# Altium schematic sheet AIR_Control1_Main_080116.SchDoc
size A3
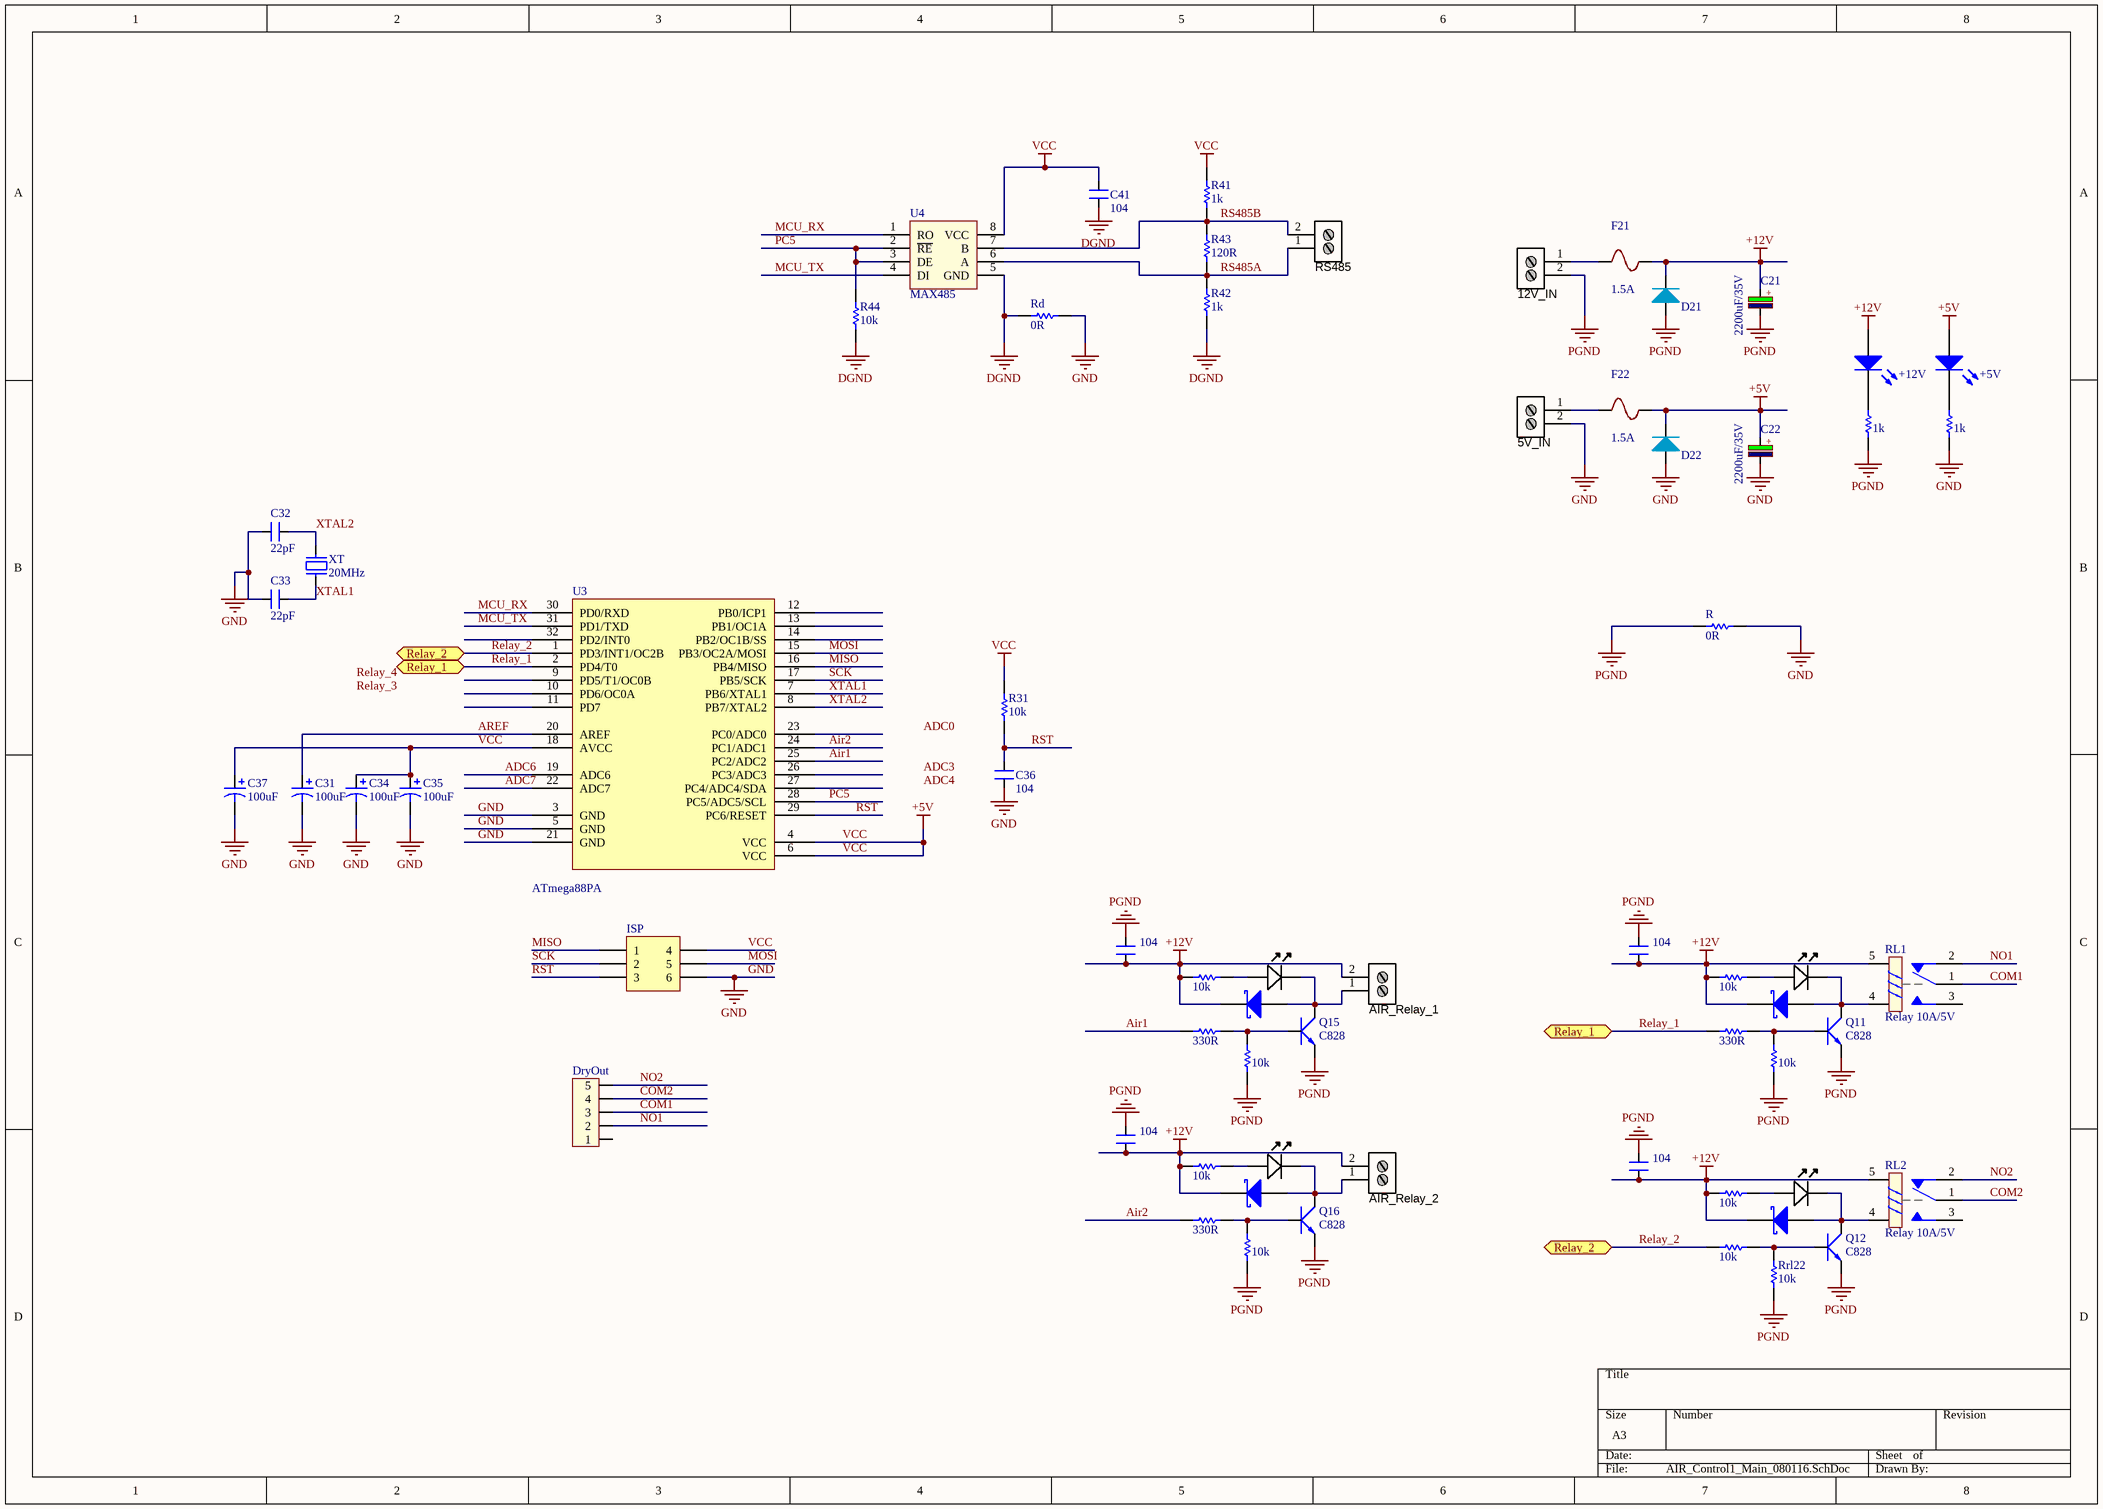
[diagram p0: AIR_Control1_Main_080116.SchDoc]

## Parts
5V_IN  Stackable ScrewTerm  [2P_PCB_ScrewTerm_200mil]  (value not drawn)
12V_IN  Stackable ScrewTerm  [2P_PCB_ScrewTerm_200mil]  (value not drawn)
+5V  Led  [LED 5mm RED]  (value not drawn)
+12V  Led  [LED 5mm RED]  (value not drawn)
AIR_Relay_1  Stackable ScrewTerm  [2P_PCB_ScrewTerm_200mil]  (value not drawn)
AIR_Relay_2  Stackable ScrewTerm  [2P_PCB_ScrewTerm_200mil]  (value not drawn)
C21  2200uF/35V  [CP_1000uF_25V]
C22  2200uF/35V  [CP_1000uF_25V]
C31  value 100uF  [CAPC2012N_F]  (hidden comment: Cap)
C32  value 22pF  [CAPC1608N]  (hidden comment: CAP NP)
C33  value 22pF  [CAPC1608N]  (hidden comment: CAP NP)
C34  value 100uF  [CAPC2012N_F]  (hidden comment: Cap)
C35  value 100uF  [CAPC2012N_F]  (hidden comment: Cap)
C36  value 104  [CAPC1608N]  (hidden comment: CAP NP)
C37  value 100uF  [CAPC2012N_F]  (hidden comment: Cap)
C41  value 104  [CAPC2012N_F]  (hidden comment: 100nF/104)
Crl1  value 104  [CAPC2012N_F]  (hidden comment: CAP NP)
Crl2  value 104  [CAPC2012N_F]  (hidden comment: CAP NP)
Crl5  value 104  [CAPC2012N_F]  (hidden comment: CAP NP)
Crl6  value 104  [CAPC2012N_F]  (hidden comment: CAP NP)
D11  Diode  [DO-214AC]  (value not drawn)
D12  Diode  [DO-214AC]  (value not drawn)
D15  Diode  [DO-214AC]  (value not drawn)
D16  Diode  [DO-214AC]  (value not drawn)
D21  Diode  [DO-214AC]  (value not drawn)
D22  Diode  [DO-214AC]  (value not drawn)
DryOut  JP5  [CON5]  (value not drawn)
E1  Blue  [LED-0805-A]  (value not drawn)
E2  Blue  [LED-0805-A]  (value not drawn)
E5  Blue  [LED-0805-A]  (value not drawn)
E6  Blue  [LED-0805-A]  (value not drawn)
F21  1.5A  [FUSE_SR-5-BK]
F22  1.5A  [FUSE_SR-5-BK]
ISP  Header 3X2A  [HDR2X3_CEN]  (value not drawn)
Q11  C828  [SOT23 TOP]
Q12  C828  [SOT23 TOP]
Q15  C828  [SOT23 TOP]
Q16  C828  [SOT23 TOP]
R  value 0R  [RESTH_AXIAL-0.4]  (hidden comment: Res)
R21  value 1k  [RESC2012N_F]  (hidden comment: Res_0805_1k)
R22  value 1k  [RESC2012N_F]  (hidden comment: Res_0805_1k)
R31  value 10k  [RESC1608N_ZERO]  (hidden comment: Res)
R41  1k  [RESC2012N_F]
R42  1k  [RESC2012N_F]
R43  value 120R  [RESC2012N_F]  (hidden comment: 330R)
R44  value 10k  [RESC2012N_F]  (hidden comment: 330R)
Rd  value 0R  [RESC2012N_F]  (hidden comment: Res)
RL1  Relay 10A/5V  [RL_5PIN]
RL2  Relay 10A/5V  [RL_5PIN]
Rl52  value 10k  [RESC1608N_ZERO]  (hidden comment: Res)
Rrl11  value 330R  [RESC1608N_ZERO]  (hidden comment: Res)
Rrl12  value 10k  [RESC1608N_ZERO]  (hidden comment: Res)
Rrl13  value 10k  [RESC1608N_ZERO]  (hidden comment: Res)
Rrl21  value 10k  [RESC1608N_ZERO]  (hidden comment: Res)
Rrl22  value 10k  [RESC1608N_ZERO]  (hidden comment: Res)
Rrl23  value 10k  [RESC1608N_ZERO]  (hidden comment: Res)
Rrl51  value 330R  [RESC1608N_ZERO]  (hidden comment: Res)
Rrl53  value 10k  [RESC1608N_ZERO]  (hidden comment: Res)
Rrl61  value 330R  [RESC1608N_ZERO]  (hidden comment: Res)
Rrl62  value 10k  [RESC1608N_ZERO]  (hidden comment: Res)
Rrl63  value 10k  [RESC1608N_ZERO]  (hidden comment: Res)
RS485  Stackable ScrewTerm  [2P_PCB1]  (value not drawn)
U3  ATmega88PA  [32PIN]
U4  MAX485  [SO-8]
XT  20MHz  [XT2]

## Ports
Relay_1, Relay_2

## Nets
+12V: +12V.1(A) AIR_Relay_1.2 AIR_Relay_2.2 C21.1 Crl1.1 Crl2.1 Crl5.1 Crl6.1 D11.2(K) D12.2(K) D15.2(K) D16.2(K) D21.2(K) F21.2 RL1.5 RL2.5 Rrl13.2 Rrl23.2 Rrl53.2 Rrl63.2
DGND: C41.1 R42.1 R44.1 Rd.1 U4.5(GND)
GND: 5V_IN.2 C22.2 C31.2 C32.2 C33.2 C34.2 C35.2 C36.1 C37.2 D22.1(A) ISP.6 R.2 R22.2 Rd.2 U3.3(GND) U3.5(GND) U3.21(GND)
PGND: 12V_IN.2 C21.2 Crl1.2 Crl2.2 Crl5.2 Crl6.2 D21.1(A) Q11.3(E) Q12.3(E) Q15.3(E) Q16.3(E) R.1 R21.2 Rl52.1 Rrl12.1 Rrl22.1 Rrl62.1
VCC: +5V.1(A) C22.1 C34.1 C35.1 C37.1 C41.2 D22.2(K) F22.2 ISP.4 R31.2 R41.2 U3.4(VCC) U3.6(VCC) U3.18(AVCC) U4.8(VCC)  [also labelled +5V]
ADC6: U3.19(ADC6)
ADC7: U3.22(ADC7)
Air1: Rrl51.1 U3.25(PC2/ADC2)
Air2: Rrl61.1 U3.24(PC1/ADC1)
AREF: C31.1 U3.20(AREF)
COM1: DryOut.3 RL1.1
COM2: DryOut.4 RL2.1
MCU_RX: U3.30(PD0/RXD) U4.1(RO)
MCU_TX: U3.31(PD1/TXD) U4.4(DI)
MISO: ISP.1 U3.16(PB4/MISO)
MOSI: ISP.5 U3.15(PB3/OC2A/MOSI)
NO1: DryOut.2 RL1.2
NO2: DryOut.5 RL2.2
PC5: R44.2 U3.28(PC5/ADC5/SCL) U4.2(~{RE}) U4.3(DE)
Relay_1: Rrl11.1 U3.2(PD4/T0) ; port Relay_1
Relay_2: Rrl21.1 U3.1(PD3/INT1/OC2B) ; port Relay_2
RS485A: R42.2 R43.1 RS485.1 U4.6(A)
RS485B: R41.1 R43.2 RS485.2 U4.7(B)
RST: C36.2 ISP.3 R31.1 U3.29(PC6/RESET)
SCK: ISP.2 U3.17(PB5/SCK)
XTAL1: C33.1 U3.7(PB6/XTAL1) XT.1
XTAL2: C32.1 U3.8(PB7/XTAL2) XT.2
Net5V_IN_1: 5V_IN.1 F22.1
Net12V_IN_1: 12V_IN.1 F21.1
Net+5V_2: +5V.2(K) R22.1
Net+12V_2: +12V.2(K) R21.1
NetAIR_Relay_1_1: AIR_Relay_1.1 D15.1(A) E5.K Q15.2(C)
NetAIR_Relay_2_1: AIR_Relay_2.1 D16.1(A) E6.K Q16.2(C)
NetD11_1: D11.1(A) E1.K Q11.2(C) RL1.4
NetD12_1: D12.1(A) E2.K Q12.2(C) RL2.4
NetE1_A: E1.A Rrl13.1
NetE2_A: E2.A Rrl23.1
NetE5_A: E5.A Rrl53.1
NetE6_A: E6.A Rrl63.1
NetQ11_1: Q11.1(B) Rrl11.2 Rrl12.2
NetQ12_1: Q12.1(B) Rrl21.2 Rrl22.2
NetQ15_1: Q15.1(B) Rl52.2 Rrl51.2
NetQ16_1: Q16.1(B) Rrl61.2 Rrl62.2

Not connected (* = marked no-connect by the designer): DryOut 1; RL1 3; RL2 3; U3 9(PD5/T1/OC0B) 10(PD6/OC0A) 11(PD7) 12(PB0/ICP1) 13(PB1/OC1A) 14(PB2/OC1B/SS) 23(PC0/ADC0) 26(PC3/ADC3) 27(PC4/ADC4/SDA) 32(PD2/INT0)

## Notes on the sheet
- Labels drawn without touching a wire or pin: ADC0, ADC3, ADC4, Relay_3, Relay_4
- (in symbol CP4) +

## Library data of the parts
5V_IN 12V_IN AIR_Relay_1 AIR_Relay_2 RS485 = 2P_ScrewTerm_90S_3.81MM: Terminal Block Screw Type THT 2-Position 3.81mm pitch; Manufacturer 1: Tyco Electronics; Manufacturer Part Number 1: 1776113-2; Value: 2 position; Pitch: 0.150" (3.81mm); Positions Per Level: 2; Package / Case: Side Entry; 3.81mm pitch; Category: Connectors Interconnects; Color: Black; Supplier 1: Digi-Key; Supplier Part Number 1: A97976-ND
+5V +12V = Led: pin to pad: 1>A 2>K
C21 C22 = CP4: Cap 1000uF/16V - 220uF/50V; Description 5: 4,7uF>10uF/250V_3,3uF>10uF/400V - 2,2uF>4,7uF/450V; Description 1: 2200uF-3300uF/6,3V - 1000uF-2200uF/10V; Description 2: 1000uF/16V - 470uF => 1000uF/25V - 100uF/100V; Description 3: 330uF>470uF/35V_220uF>470uF/50V_10uF>22uF/250V; Description 4: 220uF => 330uF/63V - 10uF =>33uF/160 - 200V; Value: 1000uF/16V
C41 = CAP NP
D11 D12 D15 D16 D21 D22 = Diode: pin to pad: 1>A 2>K
DryOut = Con5: Connector 5; Value: Connector 5
E1 E2 E5 E6 = LED_SMD_Blue_0805_100mcd: LED 0805 SMD Blue 100mcd 470nm; Manufacturer 1: Ligitek; Manufacturer Part Number 1: LG-170DBKZ-CT; Ratings: 100 mcd; 470 nm; Package / Case: 0805; Material: InGaN/GaN; Value: Blue; Color: Blue
F21 F22 = Fuse
ISP = Header 3X2A: Header, 3-Pin, Dual row; LatestRevisionDate: 17-Jul-2002; LatestRevisionNote: Re-released for DXP Platform.; Publisher: Altium Limited
Q11 Q12 Q15 Q16 = NPN: Transistor C828 C1815....
R21 R22 = Res
R41-R44 = Res: Tro dan
  R41 R42: Value: 1k
RL1 RL2 = Relay 1: Relay SPDT,10A - 12VDC 5 Pin; Value: Relay SPDT, 10A, 12V
U3 = ATmega48/168/328
U4 = MAX485: RS232 - RS485 (Same sn75176)
XT = Crystal